# EAGLE design validation-board-final (EAGLE 9.5.2)
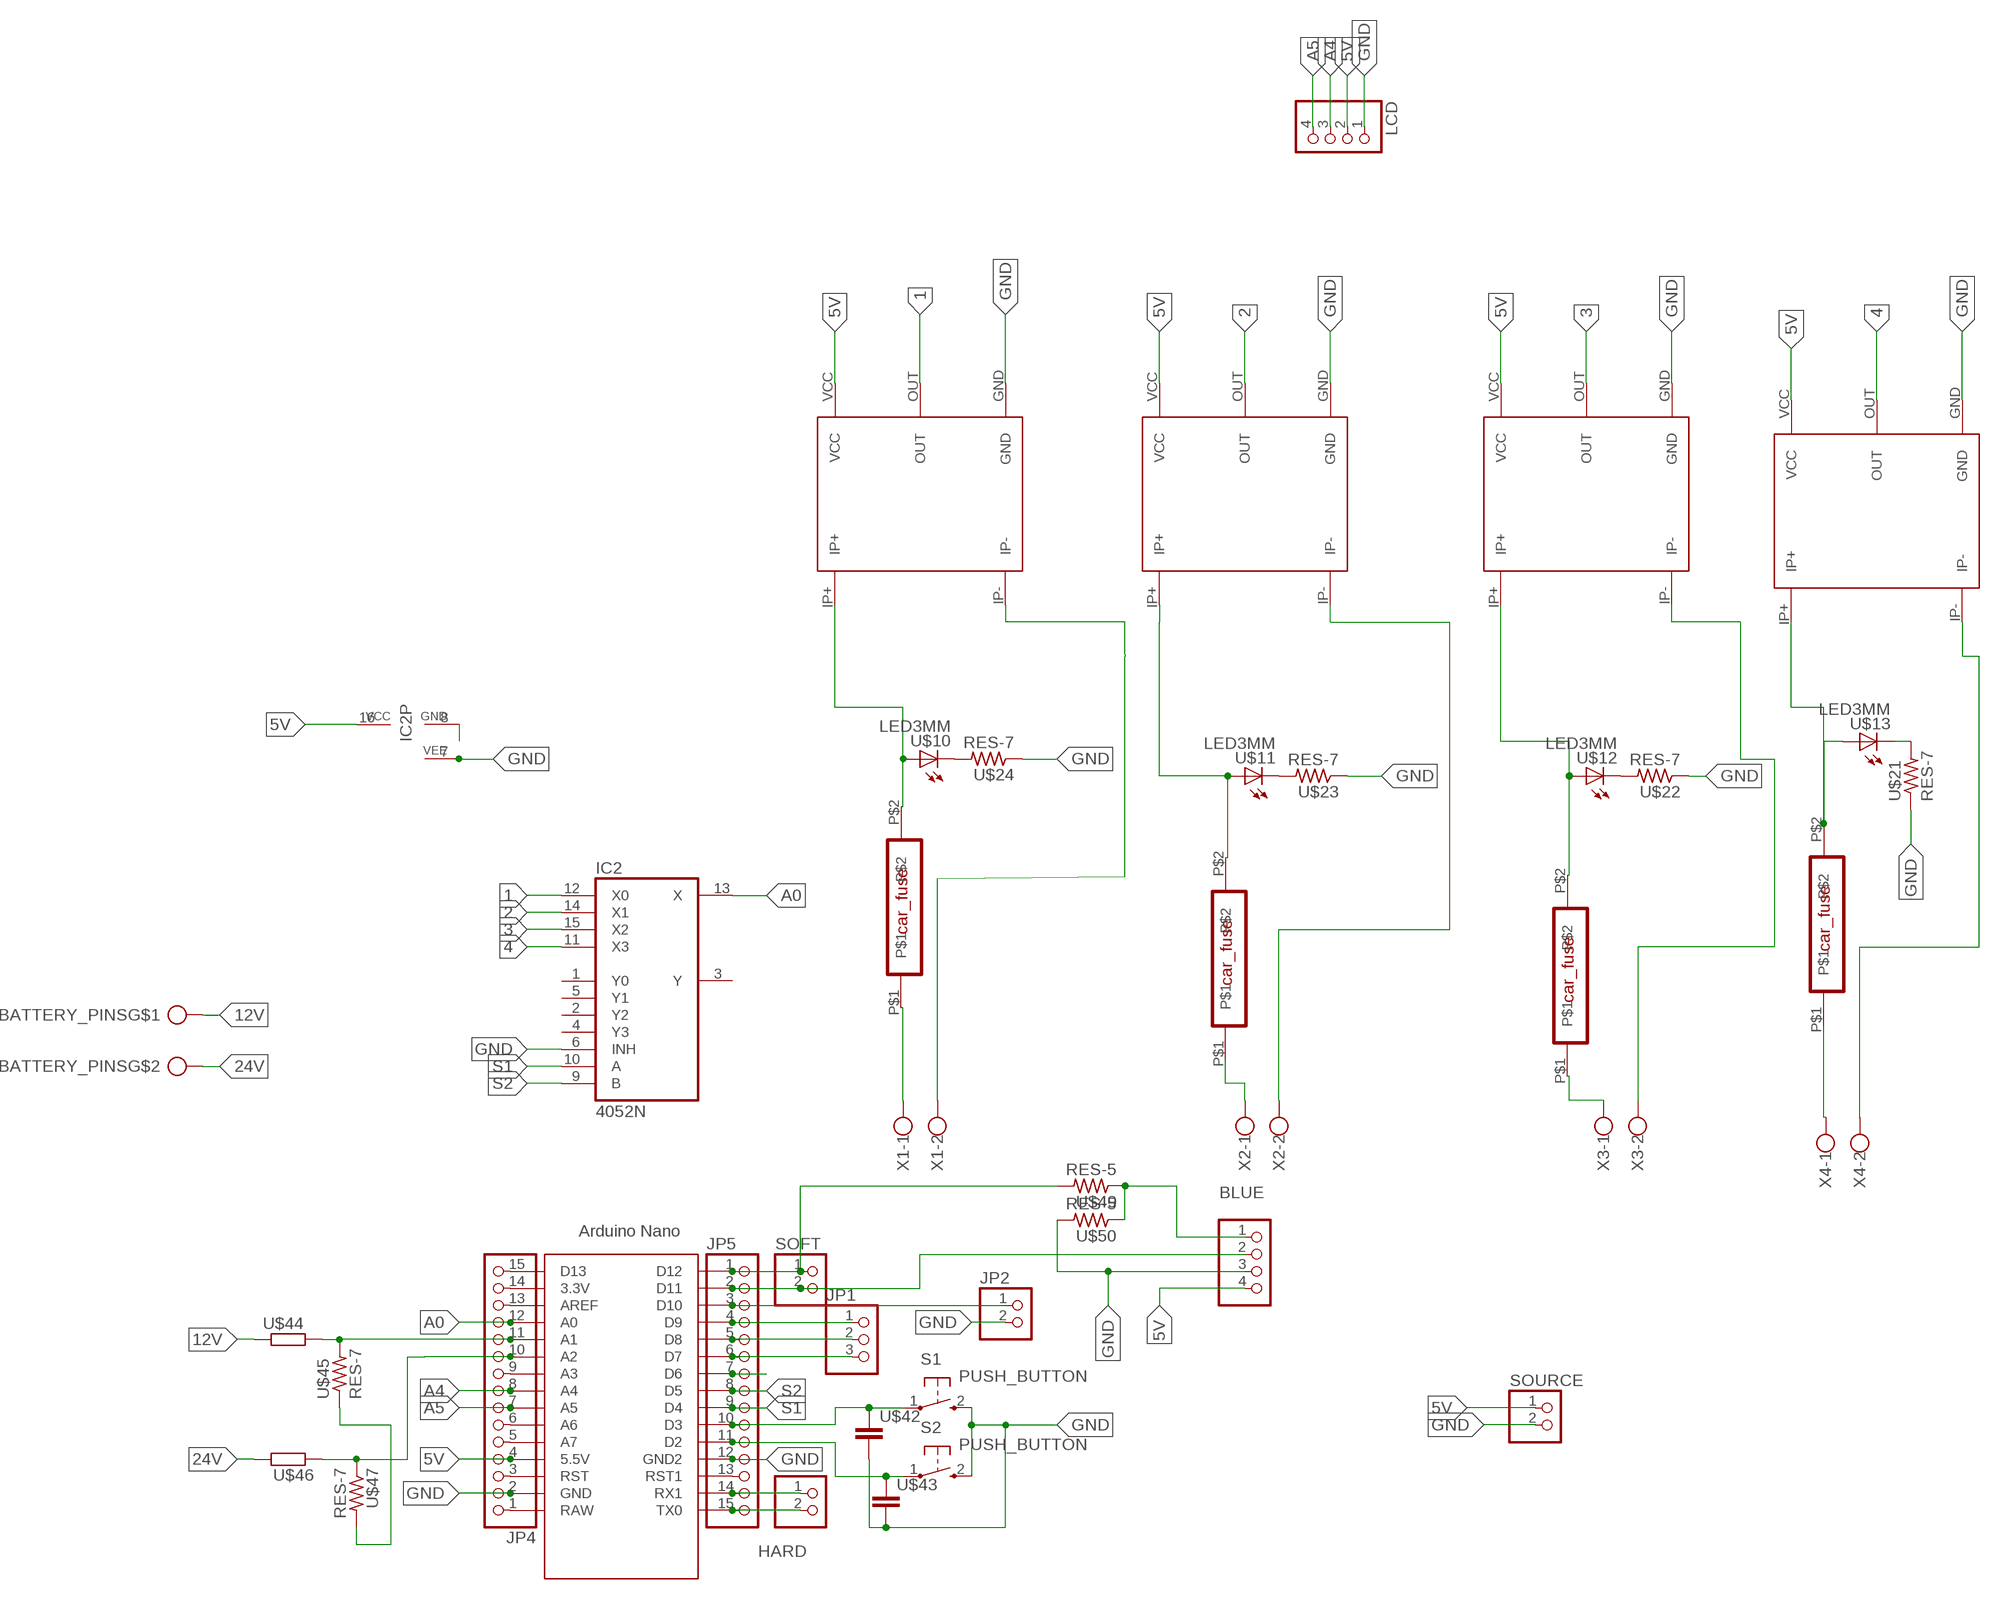
[diagram p0: schematic, sheet 1]

## Parts
BATTERY_PINS  CON_PTR_2  [AK300/2]
BLUE  PINHD-4_DATA  [1X04_DATA]
HARD  PINHD-2_DATA  [1X02_DATA]
IC2  4052N  [DIL16]
JP1  PINHD-3_DATA  [1X03_DATA]
JP2  PINHD-2_DATA  [1X02_DATA]
JP4  PINHD-1X15  [1X15]
JP5  PINHD-1X15  [1X15]
LCD  PINHD-4_DATA  [1X04_DATA]
S1  PUSH_BUTTON  [B3F-10XX]
S2  PUSH_BUTTON  [B3F-10XX]
SOFT  PINHD-2_DATA  [1X02_DATA]
SOURCE  PINHD-2_DATA  [1X02_DATA]
U$1  ARDUINO_NANO  [NANO]
U$2  CAR_FUSE  [CAR_FUSE]
U$3  CAR_FUSE  [CAR_FUSE]
U$4  CAR_FUSE  [CAR_FUSE]
U$5  CAR_FUSE  [CAR_FUSE]
U$10  LED3MM  [LED3MM]
U$11  LED3MM  [LED3MM]
U$12  LED3MM  [LED3MM]
U$13  LED3MM  [LED3MM]
U$21  RES-7  [0204/7]
U$22  RES-7  [0204/7]
U$23  RES-7  [0204/7]
U$24  RES-7  [0204/7]
U$26  ASC712_MODULE  [ASC712_MODULE]
U$27  ASC712_MODULE  [ASC712_MODULE]
U$28  ASC712_MODULE  [ASC712_MODULE]
U$29  ASC712_MODULE  [ASC712_MODULE]
U$42  CAPACITOR  [C025-025X050]
U$43  CAPACITOR  [C025-025X050]
U$44  R-EU_0207/10  [0207/10]
U$45  RES-7  [0204/7]
U$46  R-EU_0207/10  [0207/10]
U$47  RES-7  [0204/7]
U$49  RES-5  [0204/5]
U$50  RES-5  [0204/5]
X1  ROSTA.POWER  [W239-302]
X2  ROSTA.POWER  [W239-302]
X3  ROSTA.POWER  [W239-302]
X4  ROSTA.POWER  [W239-302]

## Nets
1: IC2.12(X0) U$26.OUT
2: IC2.14(X1) U$27.OUT
3: IC2.15(X2) U$28.OUT
4: IC2.11(X3) U$29.OUT
5V: BLUE.4 IC2.16(VCC) JP4.4 LCD.2 SOURCE.1 U$1.5V(5.5V) U$26.VCC U$27.VCC U$28.VCC U$29.VCC
12V: BATTERY_PINS.1 U$44.1
24V: BATTERY_PINS.2 U$46.2
A0: IC2.13(X) JP4.12 U$1.A0
A4: JP4.8 LCD.3 U$1.A4
A5: JP4.7 LCD.4 U$1.A5
GND: BLUE.3 IC2.6(INH) IC2.7(VEE) JP2.2 JP4.2 JP5.12 LCD.1 S1.2(S) S2.2(S) SOURCE.2 U$1.GND U$1.GND1(GND2) U$21.1 U$22.1 U$23.1 U$24.1 U$26.GND U$27.GND U$28.GND U$29.GND U$42.2 U$43.2 U$50.2
N$1: IC2.8(GND)
N$4: U$13.K(C) U$21.2
N$5: U$12.K(C) U$22.2
N$6: U$11.K(C) U$23.2
N$7: U$10.K(C) U$24.2
N$8: U$4.P$2 U$12.A U$28.IP+
N$10: U$2.P$1 X1.1
N$11: U$26.IP- X1.2
N$12: U$2.P$2 U$10.A U$26.IP+
N$13: U$3.P$1 X2.1
N$14: U$3.P$2 U$11.A U$27.IP+
N$15: U$27.IP- X2.2
N$16: U$5.P$1 X4.1
N$17: U$29.IP- X4.2
N$18: U$5.P$2 U$13.A U$29.IP+
N$21: U$4.P$1 X3.1
N$22: U$28.IP- X3.2
N$34: JP1.1 JP5.4 U$1.D9
N$35: JP5.10 S1.1(P) U$1.D3 U$42.1
N$43: JP4.1 U$1.RAW
N$45: JP4.3 U$1.RST
N$46: JP5.11 S2.1(P) U$1.D2 U$43.1
N$47: JP1.2 JP5.5 U$1.D8
N$48: JP1.3 JP5.6 U$1.D7
N$49: BLUE.2 JP5.2 SOFT.2 U$1.D11
N$50: JP5.1 SOFT.1 U$1.D12 U$49.2
N$51: JP2.1 JP5.3 U$1.D10
N$52: HARD.1 JP5.14 U$1.RX1
N$53: HARD.2 JP5.15 U$1.TX0
N$54: JP4.5 U$1.A7
N$55: JP4.6 U$1.A6
N$56: JP4.11 U$1.A1 U$44.2 U$45.2
N$57: U$45.1 U$47.2
N$58: JP4.10 U$1.A2 U$46.1 U$47.1
N$59: JP4.9 U$1.A3
N$60: JP4.13 U$1.AREF
N$61: JP4.14 U$1.3.3V
N$62: JP4.15 U$1.D13
N$63: JP5.13 U$1.RST1
N$65: BLUE.1 U$49.1 U$50.1
S1: IC2.10(A) JP5.9 U$1.D4
S2: IC2.9(B) JP5.8 U$1.D5
S3: JP5.7 U$1.D6
Unconnected: IC2.1(Y0) IC2.2(Y2) IC2.3(Y) IC2.4(Y3) IC2.5(Y1)

## Library data of the parts
BATTERY_PINS = MIA_LIBRARY-2-2-2:CON_PTR_2
BLUE LCD = MIA_LIBRARY-2-2-2:PINHD-4_DATA: PIN HEADER
HARD JP2 SOFT SOURCE = MIA_LIBRARY-2-2-2:PINHD-2_DATA: PIN HEADER
IC2 = 40xx:4052: Dual 4-channel ANALOG MULTIPLEXER
JP1 = MIA_LIBRARY-2-2-2:PINHD-3_DATA: PIN HEADER
JP4 JP5 = pinhead:PINHD-1X15: PIN HEADER
S1 S2 = MIA_LIBRARY-2-2-2:PUSH_BUTTON: OMRON SWITCH
U$1 = MIA_LIBRARY-2-2-2:ARDUINO_NANO: Arduino Nano
U$2-U$5 = MIA_LIBRARY-2-2-2:CAR_FUSE
U$10-U$13 = MIA_LIBRARY-2-2-2:LED3MM
U$21-U$24 U$45 U$47 = MIA_LIBRARY-2-2-2:RES-7
U$26-U$29 = MIA_LIBRARY-2-2-2:ASC712_MODULE
U$42 U$43 = MIA_LIBRARY-2-2-2:CAPACITOR
U$44 U$46 = rcl:R-EU_: RESISTOR, European symbol; SPICEPREFIX: R
U$49 U$50 = MIA_LIBRARY-2-2-2:RES-5
X1-X4 = MIA_LIBRARY-2-2-2:ROSTA.POWER: WAGO SCREW CLAMP; OC_FARNELL: unknown; OC_NEWARK: unknown

## Board
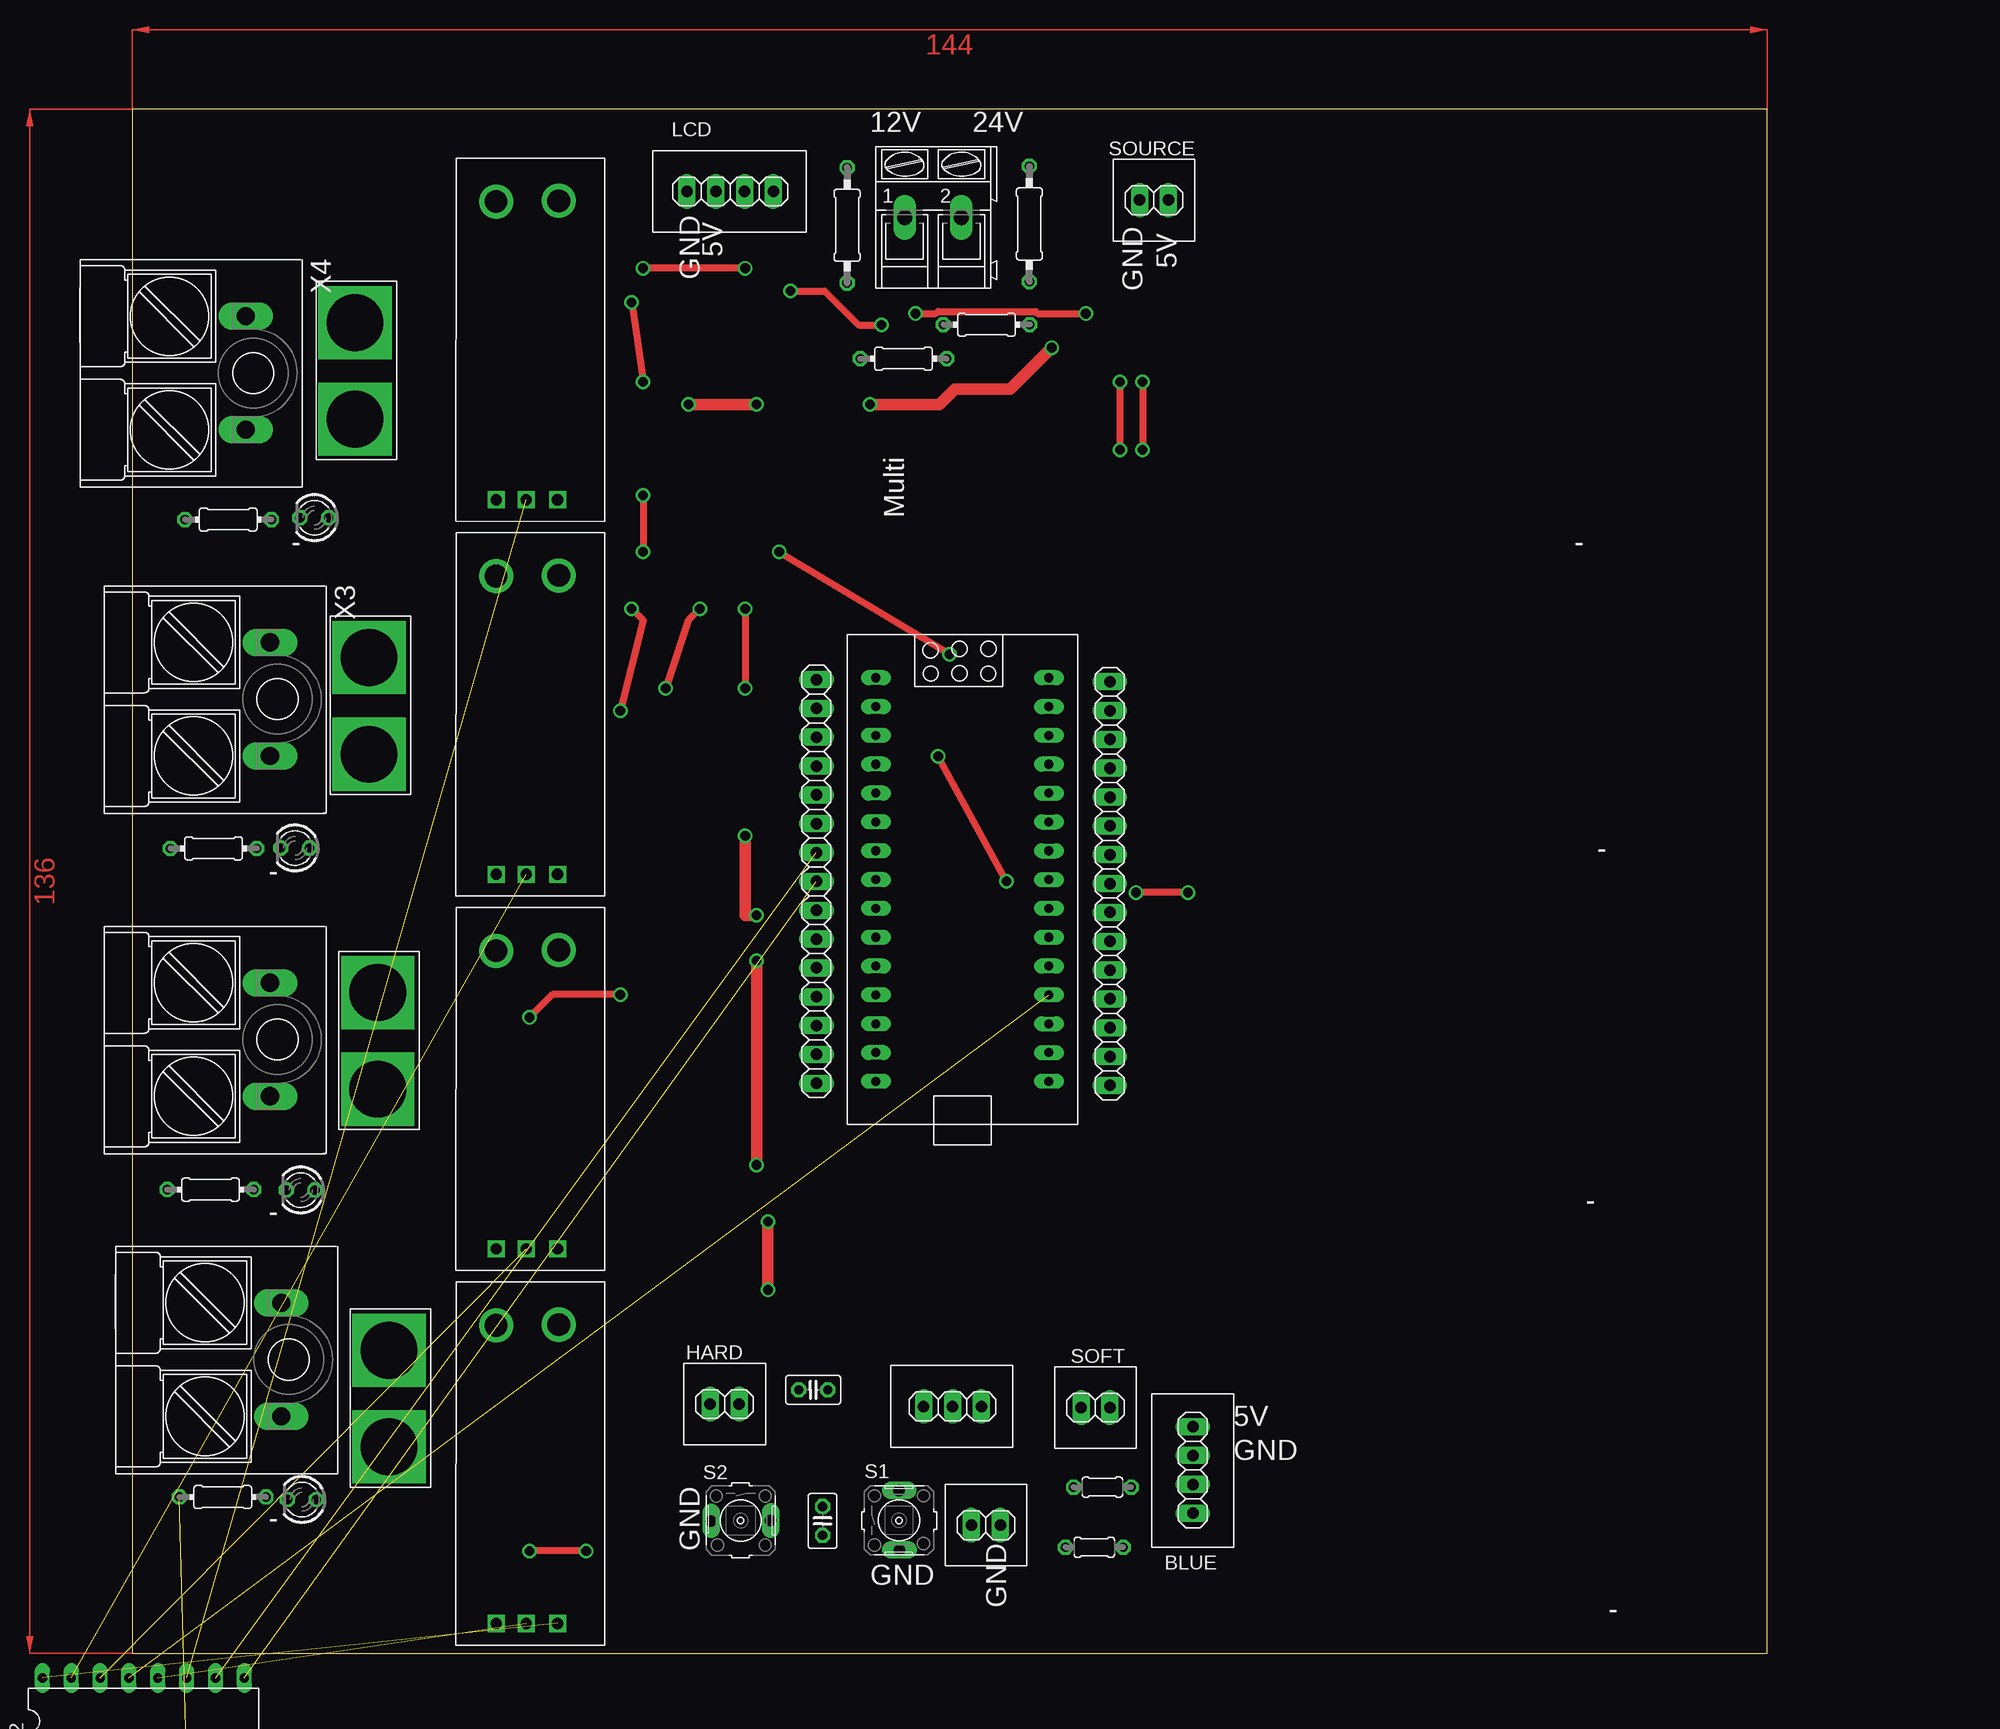
[diagram p1: board, top side]
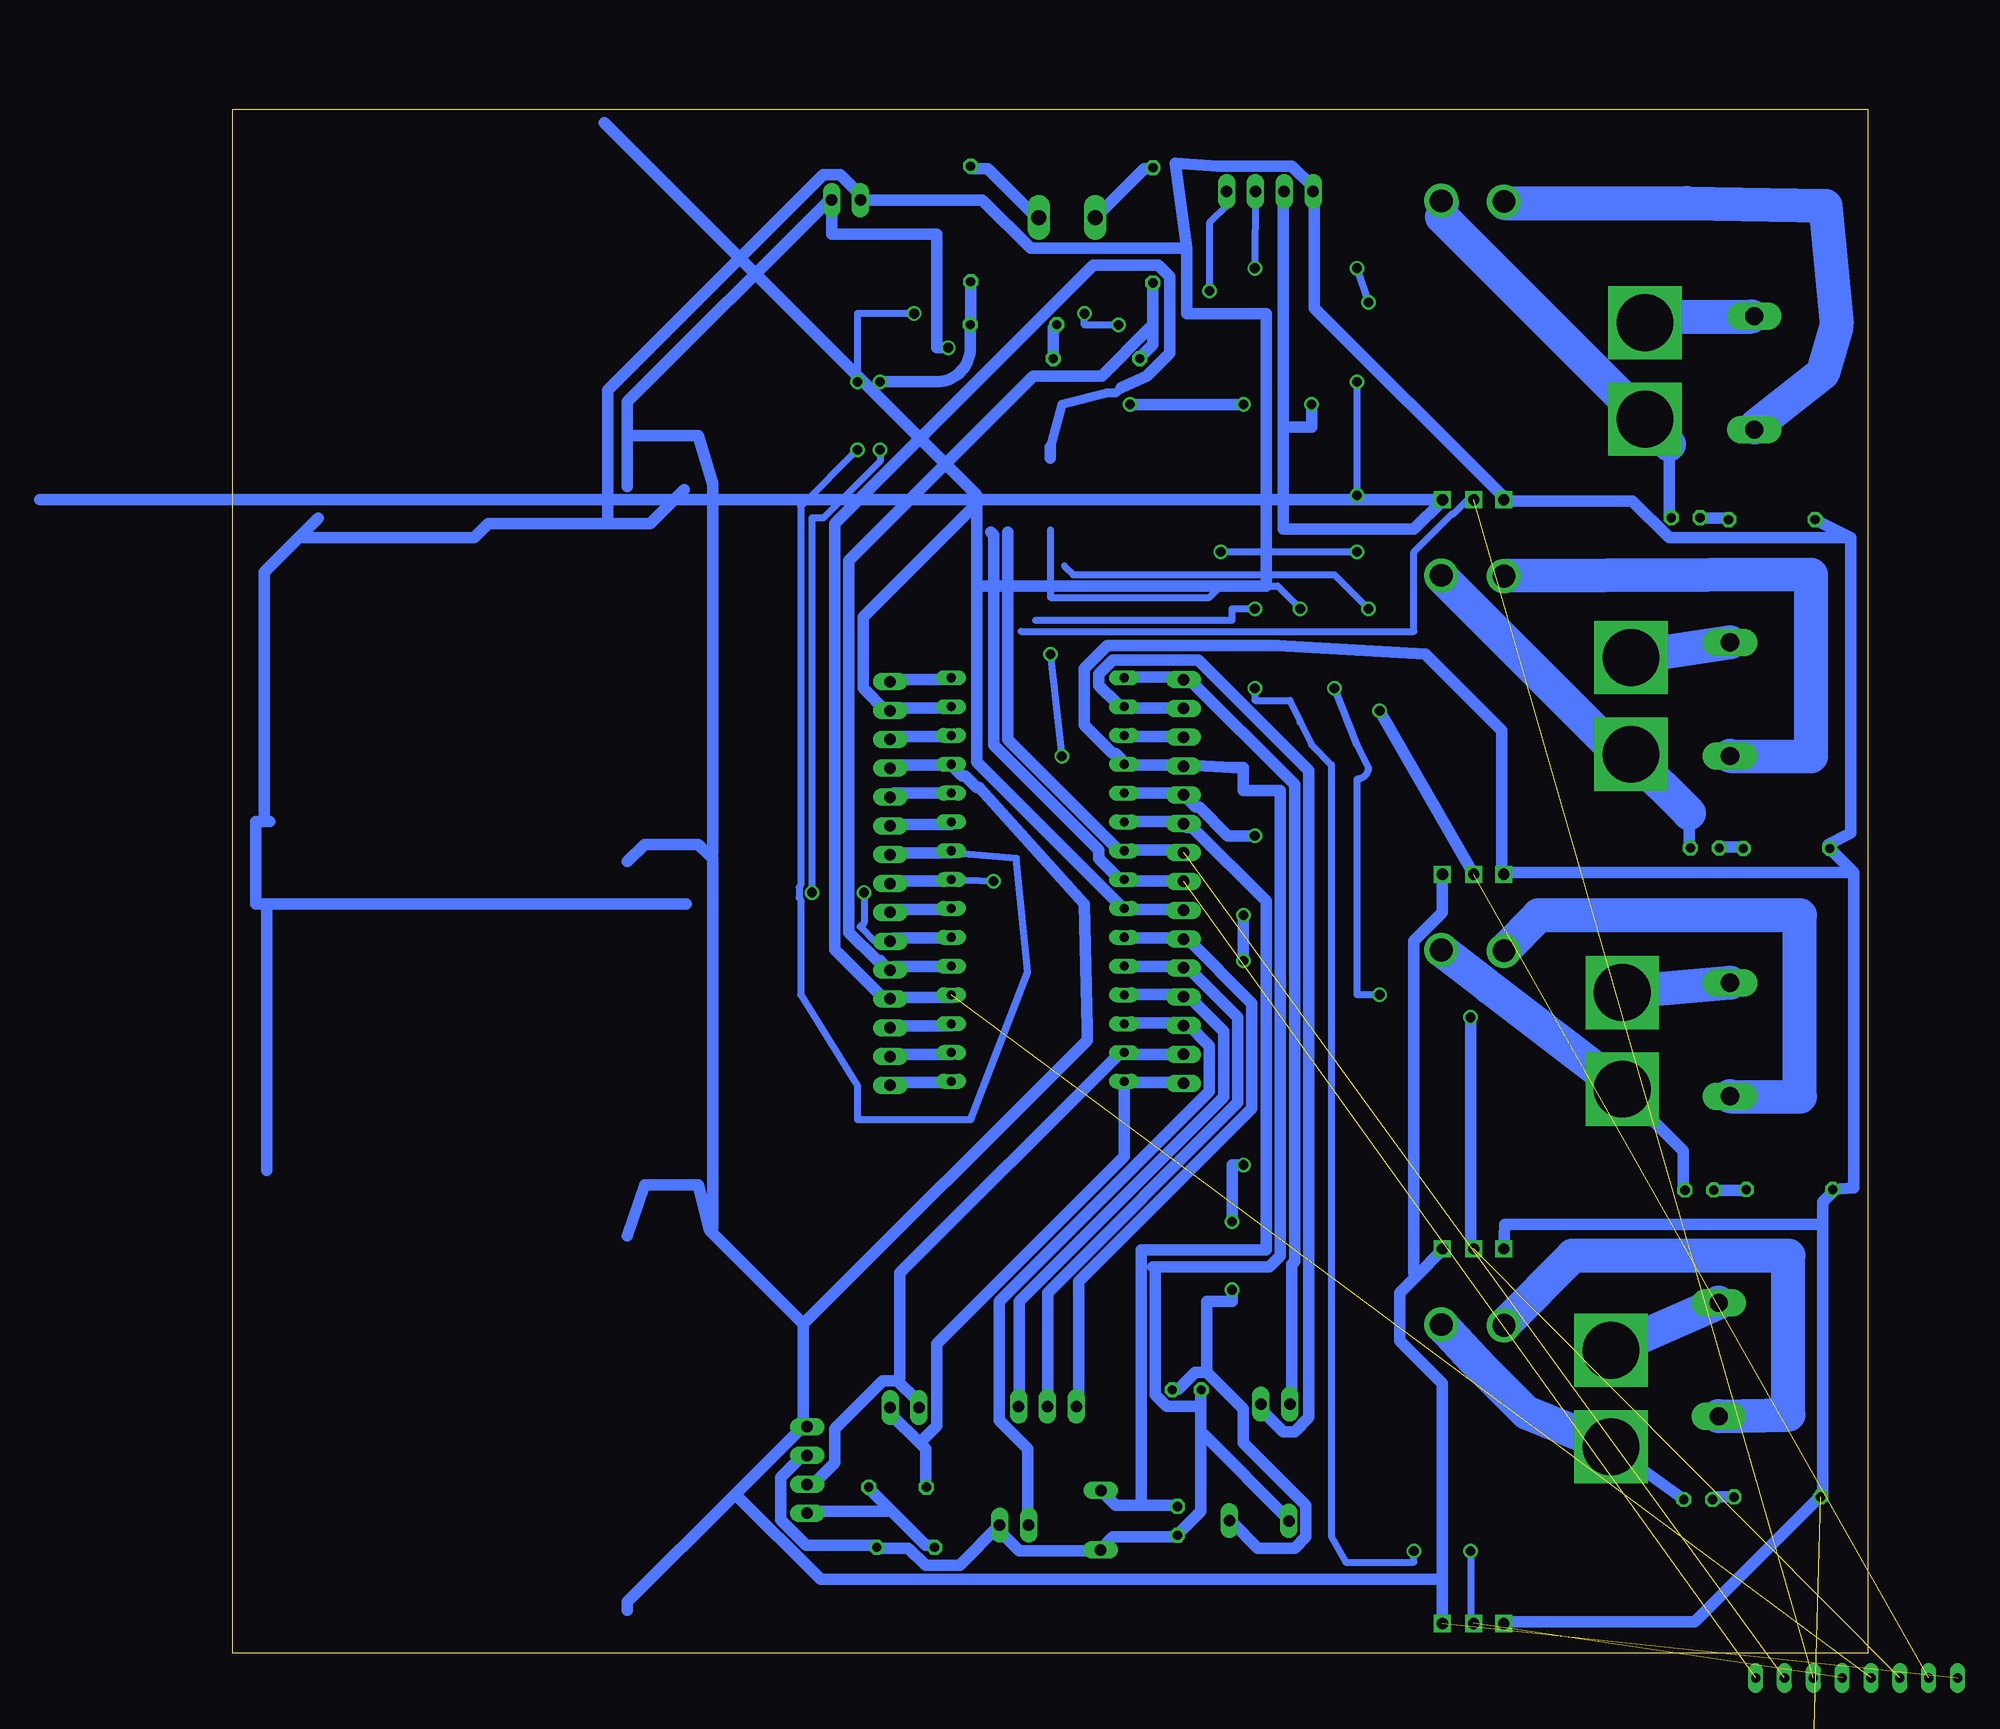
[diagram p2: board, bottom side, seen from below]

Size 144 x 136 mm. Coordinates in mm from the lower left corner, seen from the top.
Outline: 0,0 144,0 144,136 0,136 0,0
Copper layers (1*16): Top 0.035mm / dielectric 1.5mm / Bottom 0.035mm
Design rules "default *": minimum track width 1mm, minimum drill 0.35mm, track to track 0.2mm, track to pad 0.2mm, pad to pad 0.2mm, via to via 0.2mm, smd to smd 0.6mm, copper to edge 40mil, drill to drill 6mil, minimum pad ring 10mil, minimum via ring 8mil, stop-mask expansion 4mil, vias tented up to drill 0mil, thermal gap 10mil

### Footprints (pad centres in the part's own frame; a part is rotated, then mirrored left to right if it is on the bottom)
AK300/2 = drill 1.321 long: 1 -2.515,0; 2 2.489,0
1X04_DATA = drill 1.016 long: 1 -3.81,0; 2 -1.27,0; 3 1.27,0; 4 3.81,0
1X02_DATA = drill 1.016 long: 1 -1.27,0; 2 1.27,0
DIL16 = drill 0.813 long: 1 -8.89,-3.81; 2 -6.35,-3.81; 3 -3.81,-3.81; 4 -1.27,-3.81; 5 1.27,-3.81; 6 3.81,-3.81; 7 6.35,-3.81; 8 8.89,-3.81; 9 8.89,3.81; 10 6.35,3.81; 11 3.81,3.81; 12 1.27,3.81; 13 -1.27,3.81; 14 -3.81,3.81; 15 -6.35,3.81; 16 -8.89,3.81
1X03_DATA = drill 1.016 long: 1 -2.54,0; 2 0,0; 3 2.54,0
1X15 = drill 1.016 long: 1 -17.78,0; 2 -15.24,0; 3 -12.7,0; 4 -10.16,0; 5 -7.62,0; 6 -5.08,0; 7 -2.54,0; 8 0,0; 9 2.54,0; 10 5.08,0; 11 7.62,0; 12 10.16,0; 13 12.7,0; 14 15.24,0; 15 17.78,0
B3F-10XX = drill 1.016 long: 1 0.013,2.636; 2 0.029,-2.605
NANO = drill 0.8 long: 3.3V -10.16,24.13; 5V -10.16,-1.27; A0 -10.16,19.05; A1 -10.16,16.51; A2 -10.16,13.97; A3 -10.16,11.43; A4 -10.16,8.89; A5 -10.16,6.35; A6 -10.16,3.81; A7 -10.16,1.27; AREF -10.16,21.59; D2 5.08,1.27; D3 5.08,3.81; D4 5.08,6.35; D5 5.08,8.89; D6 5.08,11.43; D7 5.08,13.97; D8 5.08,16.51; D9 5.08,19.05; D10 5.08,21.59; D11 5.08,24.13; D12 5.08,26.67; D13 -10.16,26.67; GND -10.16,-6.35; GND1 5.08,-1.27; RAW -10.16,-8.89; RST -10.16,-3.81; RST1 5.08,-3.81; RX1 5.08,-6.35; TX0 5.08,-8.89
CAR_FUSE = drill 5 pad 6.452 square: P$1 2.794,-0.127; P$2 11.303,-0.127
LED3MM = drill 0.813 octagon: A -1.27,0; K 1.27,0
0204/7 = drill 0.813 octagon: 1 -3.81,0; 2 3.81,0
ASC712_MODULE = drill 1 square: GND 1.918,17.396; OUT -0.717,17.396; VCC -3.479,17.396 | drill 2: IP+ -3.579,-8.936; IP- 1.936,-8.871
C025-025X050 = drill 0.813 octagon: 1 -1.27,0; 2 1.27,0
0207/10 = drill 0.813 octagon: 1 -5.08,0; 2 5.08,0
0204/5 = drill 0.813 octagon: 1 -2.54,0; 2 2.54,0
W239-302 = drill 1.6 long: 1 -5,5; 2 5,5

### Placement (x,y rotation side)
BATTERY_PINS  70.56,126.47 0 top
BLUE  93.42,16.13 90 top
HARD  52.19,21.94 180 top
IC2  1,-6 0 top
JP1  72.26,21.73 180 top
JP2  75.2,11.27 0 top
JP4  86.11,67.79 270 top
JP5  60.27,67.98 90 top
LCD  52.68,128.76 0 top
S1  67.55,11.69 0 top
S2  53.6,11.68 270 top
SOFT  84.85,21.62 180 top
SOURCE  90,128 180 top
U$1  70.59,77.03 180 top
U$2  22.76,29.47 270 top
U$3  21.76,60.98 270 top
U$4  21,90.49 270 top
U$5  19.76,120 270 top
U$10  14.96,13.52 180 top
U$11  14.85,40.78 180 top
U$12  14.36,70.92 180 top
U$13  16.06,100.02 180 top
U$21  8.47,99.86 0 top
U$22  7.18,70.89 0 top
U$23  6.91,40.83 0 top
U$24  7.99,13.75 0 top
U$26  34,20 180 top
U$27  34,53 180 top
U$28  34,86 180 top
U$29  34,119 180 top
U$42  60.81,11.64 270 top
U$43  59.99,23.19 180 top
U$44  62.97,125.78 270 top
U$45  67.94,114.03 180 top
U$46  79.03,125.9 90 top
U$47  75.26,117.03 180 top
U$49  85.46,14.62 180 top
U$50  84.75,9.32 0 top
X1  8.15,25.86 270 top
X2  7.15,54.05 270 top
X3  7.15,84.04 270 top
X4  5.02,112.77 270 top

### Tracks (layer width: path | path; a pad name or v marks a point on that pad's centre or on a via)
1  (via drill 0.85)  (1 unrouted)
  Top 0.6: v54,92 v54,85 | v40,9 v35,9
  Bottom 0.6: v54,92 56,92 56,91 73.31,91 | v54,85 54,83.91 50.91,83.91 50,82 49,80 47.25,78.25 47.25,10.25 46,8 40,8 v40,9 | v35,9 35,2.6 U$26.OUT
2  (via drill 0.85)  (1 unrouted)
  Top 0.6: v50,92 49,91 v47,85 | v43,58 37,58 v35,56
  Bottom 0.6: 72,98.95 72,93 58,93 57,94 52,94 v50,92 | v47,85 45,80 44,78 arc90 45,77 45,58 v43,58
  Bottom 1: U$27.OUT 35,35.89 v35,56
3  (via drill 0.85)  (1 unrouted)
  Top 0.6: v44,92 45,91 v43,83
  Bottom 0.6: 70.77,95.77 70,95 47,95 v44,92
  Bottom 1: U$28.OUT v43,83
4  (1 unrouted)
  Bottom 0.6: 74.58,90 40,90 40,97 36.65,100.35 36.52,100.35 35.26,101.6 U$29.OUT
5V  (via drill 0.85)  (1 unrouted)
  Top 1: v65,110 71.11,110 72.45,111.34 77.34,111.34 v81,115 | v55,110 v49,110
  Bottom 1: 37.5,6.5 37.5,23.75 41.25,27.5 41.25,31.75 39.75,33.25 | 37.5,6.5 37.5,2.75 U$26.VCC | 39.75,33.25 37.5,35.5 U$27.VCC | U$28.VCC 37.5,68.5 37.5,65.25 40,62.75 40,33.5 39.75,33.25 | 109.25,107.25 109.25,110.25 91.5,128 SOURCE.1 91.27,125 82,125 82,115 v81,115 | 109.25,107.25 109.25,102.75 | JP4.4 86,78 85.75,78.25 80.75,78.25 U$1.5V 80.5,78 79.75,77.25 79.5,77.25 78.5,76.25 78.25,76.25 69,66 68.76,55.01 | 109.25,3.75 109.25,4.5 99.75,14 | 99.75,14 94,19.75 93.5,19.75 BLUE.4 93.75,20.25 93.75,29 | 109.25,36.75 107.75,41.25 103,41.25 102,37.25 | 93.75,29 102,37.25 | 109.25,69.75 107.75,71.25 103,71.25 102,70.25 | 102,70.25 101.75,70 101.75,37.5 102,37.25 | 68.75,54.5 68.76,55.01 | 109.25,107.25 103,107.25 101.75,103 101.75,70.5 102,70.25 | 37.5,6.5 92.25,6.5 99.75,14 | 161.01,101.6 U$29.VCC 37.5,101.5 40,99 51.5,99 51.5,108 | 51.5,108 51.5,128.75 LCD.2 | 68.76,55.01 68.76,53.99 93.75,29 | v65,110 v55,110 | v49,110 49,108 51.5,108
12V
  Bottom 1: U$44.1 63,130.75 63.75,130.75 68,126.5 BATTERY_PINS.1
24V
  Bottom 1: U$46.2 79,130.75 77.5,130.75 73.25,126.5 BATTERY_PINS.2
A0  (1 unrouted)
  Bottom 0.8: 72,106.25 71,110 67,111 66.25,111 65.75,111.5
  Bottom 1: 72,106.25 72,105.25 | 65.75,111.5 63.5,112.5 61.5,114.5 61.5,121.25 62.5,122.25 68.25,122.25 91,99.5 91,62 86.75,57.75 86.25,57.75 JP4.12 85.75,57.75 80.75,57.75 U$1.A0
A4  (via drill 0.85)
  Top 0.6: v54,122 v45,122 | v44,119 v45,112 | v45,102 v45,97 | v57,97 v72,88 | v77,68 v71,79
  Bottom 0.6: LCD.3 v54,122 | v45,122 v44,119 | v45,112 v45,102 | v45,97 v57,97 | v72,88 v71,79 | U$1.A4 v77,68
  Bottom 1: U$1.A4 80.75,68 86,68 JP4.8
A5  (via drill 0.85)
  Top 0.6: v58,120 61,120 64,117 v66,117 | v69,118 70.78,118 70.97,118.19 79.55,118.19 79.74,118 v84,118 | v89,112 v89,106
  Bottom 0.6: LCD.4 56.49,127.51 58,126 v58,120 | v66,117 69,117 v69,118 | v84,118 89,118 v89,112 | v89,106 94,101 94,67.61 94.14,67.47 94.14,66.53 94,66.39 94,58 89,50 89,47 79,47 74,60 75,70 80.75,70.5
  Bottom 1: U$1.A5 80.75,70.5 86,70.5 JP4.7
GND  (2 unrouted)
  Bottom 1: 141.25,73.25 141.25,95.25 138,98.5 | 136.5,100 138,98.5 | 140.75,73.25 141.25,73.25 | 104.25,102.5 107.25,99.5 111,99.5 | 111,99.5 121.5,99.5 122.75,98.25 137.75,98.25 138,98.5 | 111,99.5 111,111.25 92,130.25 90.5,130.25 88.75,128.5 88.75,128 SOURCE.2 78,128 73.75,123.75 60,123.75 | BLUE.3 93.5,17.25 94,17.25 95.75,15.5 95.75,11.75 93.5,9.5 87.75,9.5 U$50.2 87.25,9.25 84.5,9.25 83,7.75 80,7.75 76.5,11.25 JP2.2 76.5,10.75 74.75,9 68,9 S1.2 67.5,9.25 66.5,10.25 61,10.25 U$42.2 60.5,10.75 58.75,12.5 58.75,19.25 | 58.75,19.25 58.75,21.75 | 58.75,21.75 58.75,23 U$43.2 | S2.2 51,11.75 58.5,19.25 58.75,19.25 | U$1.GND 80.75,83.25 86,83.25 JP4.2 86.5,83 88.5,85 88.5,91.25 78.5,101.25 | 78.5,101.25 78.5,102 111.32,134.82 | 78.5,101.25 78.5,94 53,94 53,118 60,118 60,123.75 | 1.25,68.75 3.25,70.75 U$22.1 3.5,71.25 1.5,72.25 1.5,98.25 | 1.25,68.75 1.25,41 U$23.1 3.25,40.5 4,39.75 4,37.75 | 4,37.75 4,13.75 U$24.1 4.5,13.5 15.25,2.75 32,2.75 U$26.GND | 1.5,98.25 4.5,99.75 U$21.1 | 4,37.75 32,37.75 U$27.GND | 1.25,68.75 32,68.75 U$28.GND 32.25,69 32.25,81.25 39,88 52,88.75 67,88.75 69,86.75 69,81.75 66.5,79.25 66.25,79.25 65.75,78.75 U$1.GND1 65.5,78.25 60.5,78.25 JP5.12 60,78.25 56,78 55,78 55,76 51.75,76 51.75,35 52.75,34 63,34 62.75,33.75 62.75,22.75 61.75,21.75 58.75,21.75 | 1.5,98.25 17.5,98.25 20.75,101.5 32,101.5 U$29.GND 32.25,102 48.75,118.5 48.75,128.75 LCD.1 49,129.25 50.75,131 57.25,131 61,131.25 60,123.75 | 141.25,73.25 142,73.25 142,66 141,66 | 104.08,66 141,66 | 141,66 141,42.5
N$4
  Bottom 1: U$21.2 12.5,100 14.75,100 U$13.K
N$5
  Bottom 1: U$22.2 11,71 13,71 U$12.K
N$6
  Bottom 1: U$23.2 10.75,40.75 13.5,40.75 U$11.K
N$7
  Bottom 1: U$24.2 12,13.75 13.5,13.75 U$10.K
N$8
  Bottom 1: 15.75,74 15.75,71 U$12.A | 20.75,79 U$4.P$2 21.25,79.5 22.25,79.5 | 37.5,94.75 U$28.IP+
  Bottom 3: 20.75,79 15.75,74 | 22.25,79.5 37.5,94.75
N$10
  Bottom 3: X1.1 U$2.P$1
N$11
  Bottom 3: X1.2 7,21 7,35 26,35 U$26.IP-
N$12
  Bottom 1: U$10.A U$2.P$2
  Bottom 3: U$2.P$2 30.06,21.17 33.94,25.06 U$26.IP+
N$13
  Bottom 3: X2.1 U$3.P$1
N$14
  Bottom 1: U$11.A 16.25,41 16.25,44.25 21.5,49.5 U$3.P$2
  Bottom 3: U$3.P$2 33.31,58.66 33.36,58.66 33.37,58.67 33.39,58.67 33.58,58.86 U$27.IP+
N$15
  Bottom 3: X2.2 6,49 6,65 29,65 U$27.IP-
N$16
  Bottom 1: 19,117.75 19.5,117.25 U$5.P$1 | 10.25,117.75 X4.1
  Bottom 3: 19,117.75 10.25,117.75
N$17
  Bottom 1: 10,108 X4.2 | 32,127.75 U$29.IP-
  Bottom 3: 10,108 4,112.75 2.75,117 3.75,127.5 16,127.75 32,127.75
N$18
  Bottom 1: 17.5,106.5 17.5,100.25 U$13.A | 19.5,108.5 U$5.P$2 20,109 | 37.5,126.5 37.5,127.75
  Bottom 3: 19.5,108.5 17.5,106.5 | 20,109 37.5,126.5 | 37.5,127.75 U$29.IP+
N$21
  Bottom 3: X3.1 U$4.P$1
N$22
  Bottom 3: X3.2 5,79 5,95 U$28.IP-
N$34
  Bottom 1: U$1.D9 65.5,58 60.5,58 JP5.4 60,58 56.75,54.75 56.75,49 74.75,31 74.75,21.75 JP1.1
N$35
  Bottom 1: U$1.D3 65.5,73.25 60.5,73.25 JP5.10 60,72.75 59.5,72.75 53,66.25 53,35.5 64,35.5 64,13 | 64,13 66.25,13 67.5,14.25 S1.1 | 64,13 61,13 U$42.1
N$43
  Bottom 1: U$1.RAW 80.75,85.75 86,85.75 JP4.1
N$45
  Bottom 1: U$1.RST 80.75,80.75 85.75,80.75 86,80.5 JP4.3
N$46  (via drill 0.85)
  Top 1: v54,72 54,65 v55,65 | v55,61 v55,43 | v56,38 v56,32
  Bottom 1: 58.25,24.75 59.25,24.75 60.75,23.25 61.25,23.25 U$43.1 | 58.25,24.75 55,21.5 55,18.5 49.5,13 49.5,10.25 50.5,9.25 53.75,9.25 56,11.5 S2.1 | U$1.D2 60.5,75.75 JP5.11 59.19,74.52 58.9,74.52 56.38,72 v54,72 | v55,65 v55,61 | v55,43 56,43 v56,38 | v56,32 56,31 58.25,31 58.25,24.75
N$47
  Bottom 1: U$1.D8 65.5,60.5 60.5,60.5 JP5.5 60,60.5 55.5,56 55.5,48.5 72.25,31.75 72.25,21.75 JP1.2
N$48
  Bottom 1: U$1.D7 65.5,63 60.5,63 JP5.6 60,63 54.25,57.25 54.25,48 69.5,32.75 69.5,21.75 JP1.3
N$49
  Bottom 1: JP5.2 60.5,52.75 65.5,52.75 U$1.D11 66,52.75 85.25,33.5 85.25,24.25 85.5,24 | 85.5,24 83.75,22.25 83.75,21.75 SOFT.2 | 85.5,24 86.75,24 91,19.75 91,16.75 92.75,15 93.25,15 BLUE.2
N$50
  Bottom 1: JP5.1 60.5,50.25 65.5,50.25 U$1.D12 65.5,49.75 65.5,43.75 82,27.25 82,20 83.5,18.5 | 83.5,18.5 86,21 86,21.5 SOFT.1 | 83.5,18.5 83,18 83,14.75 U$49.2
N$51
  Bottom 1: U$1.D10 65.5,55.5 60.5,55.5 JP5.3 60,55.5 58,53.5 58,49.5 76.5,31 76.5,20.5 74,18 74,11.5 JP2.1
N$52
  Bottom 1: JP5.14 60.5,83.25 65.5,83.25 U$1.RX1 66,83.5 67.75,85.25 67.75,86.25 66.5,87.5 59,87.5 49.25,77.75 49.25,20.75 50.5,19.5 51.5,19.5 53.25,21.25 53.25,21.75 HARD.1
N$53
  Bottom 1: U$1.TX0 65.5,86 60.5,86 JP5.15 60,86 50.5,76.5 50.5,34.5 50.75,34.25 50.75,22 HARD.2
N$54
  Bottom 1: U$1.A7 85.75,75.75 86,75.5 JP4.5
N$55
  Bottom 1: U$1.A6 80.75,73 86,73 JP4.6
N$56
  Bottom 1: U$1.A1 80.75,60.5 85.75,60.5 86,60.25 JP4.11 86.5,60.5 87,61 87.25,61 89.75,63.5 89.75,96.25 73.5,112.5 67.5,112.5 63.25,116.75 63,116.75 | 63,116.75 63,115.25 64,114.25 U$45.2 | 63,116.75 63,120.5 U$44.2
N$57
  Bottom 1: U$45.1 71.75,116.75 71.5,117 U$47.2
N$58  (via drill 0.85)
  Top 0.6: v87,112 v87,106 | v93,67 v88.41,67
  Bottom 0.6: v87,106 87,105 92,100 93,100 v93,67 | v88.41,67 88.41,64.34 88.75,64 87.5,62.75 86,62.75
  Bottom 1: U$1.A2 80.75,63 85.75,63 86,62.75 JP4.10 | U$46.1 79,120.75 79,117.25 U$47.1 79.07,114.93 arc90 82,112 v87,112
N$59
  Bottom 1: U$1.A3 80.75,65.5 85.75,65.5 86,65.25 JP4.9
N$60
  Bottom 1: U$1.AREF 80.75,55.25 86,55.25 JP4.13
N$61
  Bottom 1: U$1.3.3V 80.75,52.75 86,52.75 JP4.14
N$62
  Bottom 1: U$1.D13 80.75,50.25 86,50.25 JP4.15
N$63
  Bottom 1: U$1.RST1 65.5,80.75 60.5,80.75 JP5.13
N$65
  Bottom 1: 86.25,12.75 88,14.5 U$49.1 | 86.25,12.75 83,9.5 82.25,9.5 U$50.1 | BLUE.1 93.25,12.5 86.5,12.5 86.25,12.75
S1  (1 unrouted)
  Bottom 1: 75.75,98.75 75.75,80.5 65.75,70.5 U$1.D4 65,70.75 60.5,70.75 JP5.9
S2  (1 unrouted)
  Bottom 1: 77.25,98.75 77,98.5 77,80 67.75,70.75 67.75,70 65.75,68 U$1.D5 65.25,68 60.5,68 JP5.8
S3
  Bottom 1: 78.5,98.75 78.5,78.5 65.75,65.75 U$1.D6 65,65.5 60.5,65.5 JP5.7
(copper drawn outside any net)
  shapes: Top area x2

### Text on the board
tNames: 12V | 24V | 5V | 5V | GND | GND | Multi | - | - | - | - | - | - | 5V | GND | - | GND | GND | GND | -